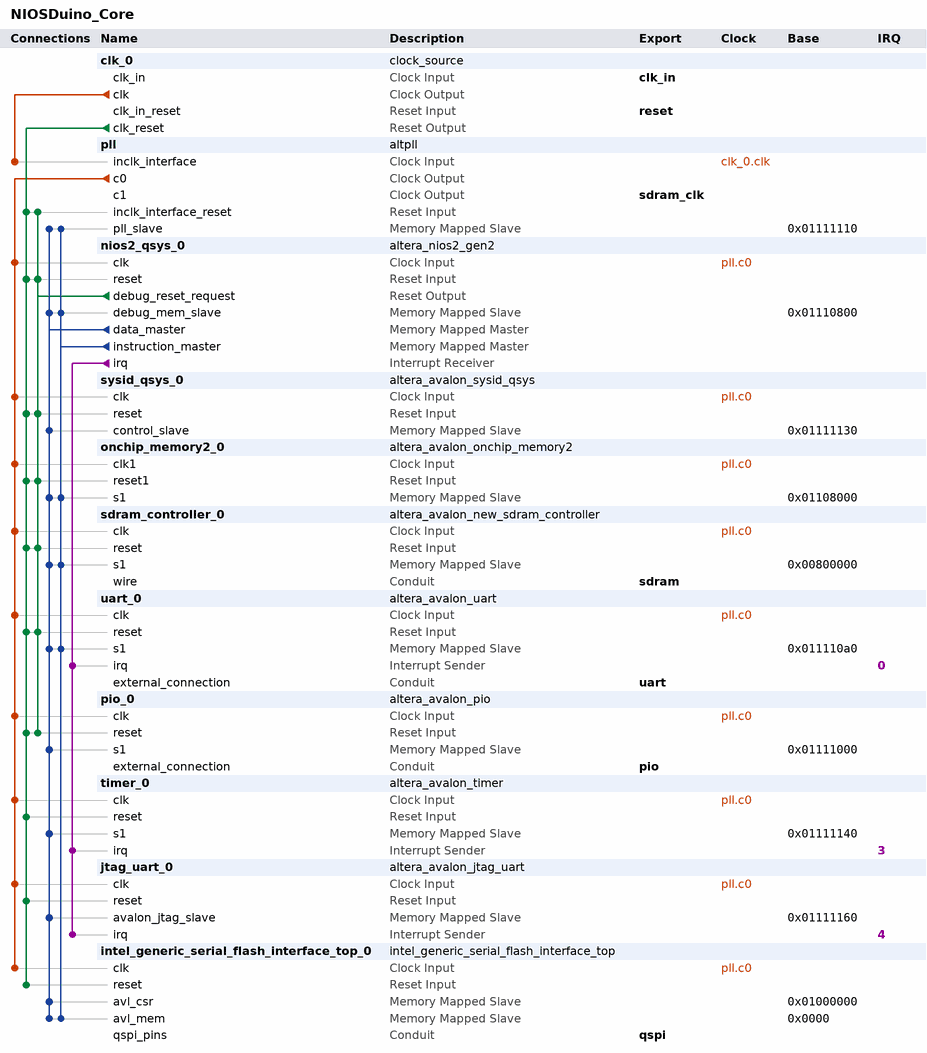
[diagram p0: system contents]
# Platform Designer (Qsys) system NIOSDuino_Core, MAX 10 10M08SAU169C8G
# Parameters at their usual value, and those the tool derives, are not listed.
package require -exact qsys 18.1
create_system NIOSDuino_Core
set_project_property DEVICE_FAMILY {MAX 10}
set_project_property DEVICE 10M08SAU169C8G

add_instance clk_0 clock_source 18.1
set_instance_parameter_value clk_0 clockFrequency 12000000

add_instance pll altpll 18.1
set_instance_parameter_value pll CLK0_DIVIDE_BY 6
set_instance_parameter_value pll CLK0_MULTIPLY_BY 25
set_instance_parameter_value pll CLK1_DIVIDE_BY 6
set_instance_parameter_value pll CLK1_DUTY_CYCLE 50
set_instance_parameter_value pll CLK1_MULTIPLY_BY 25
set_instance_parameter_value pll CLK1_PHASE_SHIFT -5000
set_instance_parameter_value pll INCLK0_INPUT_FREQUENCY 83333
set_instance_parameter_value pll PORT_ARESET PORT_UNUSED
set_instance_parameter_value pll PORT_LOCKED PORT_UNUSED
set_instance_parameter_value pll PORT_clk1 PORT_USED
set_instance_parameter_value pll PORT_clk2 PORT_UNUSED
set_instance_parameter_value pll PORT_clk3 PORT_UNUSED

add_instance nios2_qsys_0 altera_nios2_gen2 18.1
set_instance_parameter_value nios2_qsys_0 dcache_size 2048
set_instance_parameter_value nios2_qsys_0 exceptionSlave onchip_memory2_0.s1
set_instance_parameter_value nios2_qsys_0 icache_size 4096
set_instance_parameter_value nios2_qsys_0 impl Tiny
set_instance_parameter_value nios2_qsys_0 resetSlave intel_generic_serial_flash_interface_top_0.avl_mem

add_instance sysid_qsys_0 altera_avalon_sysid_qsys 18.1
set_instance_parameter_value sysid_qsys_0 id 17149200

add_instance onchip_memory2_0 altera_avalon_onchip_memory2 18.1
set_instance_parameter_value onchip_memory2_0 dataWidth 32
set_instance_parameter_value onchip_memory2_0 dualPort false
set_instance_parameter_value onchip_memory2_0 initMemContent true
set_instance_parameter_value onchip_memory2_0 initializationFileName onchip_mem.hex
set_instance_parameter_value onchip_memory2_0 memorySize 32768
set_instance_parameter_value onchip_memory2_0 useNonDefaultInitFile true

add_instance sdram_controller_0 altera_avalon_new_sdram_controller 18.1
set_instance_parameter_value sdram_controller_0 TAC 6.0
set_instance_parameter_value sdram_controller_0 TRCD 15.0
set_instance_parameter_value sdram_controller_0 TRFC 72.0
set_instance_parameter_value sdram_controller_0 TRP 15.0
set_instance_parameter_value sdram_controller_0 casLatency 2
set_instance_parameter_value sdram_controller_0 columnWidth 8
set_instance_parameter_value sdram_controller_0 dataWidth 16
set_instance_parameter_value sdram_controller_0 generateSimulationModel false
set_instance_parameter_value sdram_controller_0 model single_Micron_MT48LC4M32B2_7_chip
set_instance_parameter_value sdram_controller_0 numberOfBanks 4
set_instance_parameter_value sdram_controller_0 numberOfChipSelects 1
set_instance_parameter_value sdram_controller_0 powerUpDelay 200.0
set_instance_parameter_value sdram_controller_0 refreshPeriod 15.625
set_instance_parameter_value sdram_controller_0 rowWidth 12

add_instance uart_0 altera_avalon_uart 18.1
set_instance_parameter_value uart_0 baud 115200
set_instance_parameter_value uart_0 dataBits 8
set_instance_parameter_value uart_0 fixedBaud true
set_instance_parameter_value uart_0 parity NONE
set_instance_parameter_value uart_0 stopBits 1

add_instance pio_0 altera_avalon_pio 18.1
set_instance_parameter_value pio_0 bitModifyingOutReg true
set_instance_parameter_value pio_0 direction Bidir
set_instance_parameter_value pio_0 width 16

add_instance timer_0 altera_avalon_timer 18.1
set_instance_parameter_value timer_0 period 1
set_instance_parameter_value timer_0 periodUnits MSEC

add_instance jtag_uart_0 altera_avalon_jtag_uart 18.1
set_instance_parameter_value jtag_uart_0 readBufferDepth 32
set_instance_parameter_value jtag_uart_0 simInteractiveOptions NO_INTERACTIVE_WINDOWS
set_instance_parameter_value jtag_uart_0 writeBufferDepth 128

add_instance intel_generic_serial_flash_interface_top_0 intel_generic_serial_flash_interface_top 18.1
set_instance_parameter_value intel_generic_serial_flash_interface_top_0 CHIP_SELECT_BYPASS false
set_instance_parameter_value intel_generic_serial_flash_interface_top_0 CHIP_SELS 1
set_instance_parameter_value intel_generic_serial_flash_interface_top_0 DEBUG_OPTION 0
set_instance_parameter_value intel_generic_serial_flash_interface_top_0 DEFAULT_VALUE_REG_0 1
set_instance_parameter_value intel_generic_serial_flash_interface_top_0 DEFAULT_VALUE_REG_1 1
set_instance_parameter_value intel_generic_serial_flash_interface_top_0 DEFAULT_VALUE_REG_2 0
set_instance_parameter_value intel_generic_serial_flash_interface_top_0 DEFAULT_VALUE_REG_3 0
set_instance_parameter_value intel_generic_serial_flash_interface_top_0 DEFAULT_VALUE_REG_4 139264
set_instance_parameter_value intel_generic_serial_flash_interface_top_0 DEFAULT_VALUE_REG_5 1771
set_instance_parameter_value intel_generic_serial_flash_interface_top_0 DEFAULT_VALUE_REG_6 1282
set_instance_parameter_value intel_generic_serial_flash_interface_top_0 DEFAULT_VALUE_REG_7 6149
set_instance_parameter_value intel_generic_serial_flash_interface_top_0 DEVICE_DENSITY 64
set_instance_parameter_value intel_generic_serial_flash_interface_top_0 ENABLE_SIM_MODEL false
set_instance_parameter_value intel_generic_serial_flash_interface_top_0 PIPE_CMD_GEN_CMD 0
set_instance_parameter_value intel_generic_serial_flash_interface_top_0 PIPE_CSR 0
set_instance_parameter_value intel_generic_serial_flash_interface_top_0 PIPE_MUX_CMD 0
set_instance_parameter_value intel_generic_serial_flash_interface_top_0 PIPE_XIP 0
set_instance_parameter_value intel_generic_serial_flash_interface_top_0 USE_CHIP_SEL_FROM_CSR 1
set_instance_parameter_value intel_generic_serial_flash_interface_top_0 gui_use_asmiblock true
set_instance_parameter_value intel_generic_serial_flash_interface_top_0 gui_use_gpio true

# connections
add_connection clk_0.clk pll.inclk_interface clock
add_connection pll.c0 intel_generic_serial_flash_interface_top_0.clk clock
add_connection pll.c0 jtag_uart_0.clk clock
add_connection pll.c0 nios2_qsys_0.clk clock
add_connection pll.c0 onchip_memory2_0.clk1 clock
add_connection pll.c0 pio_0.clk clock
add_connection pll.c0 sdram_controller_0.clk clock
add_connection pll.c0 sysid_qsys_0.clk clock
add_connection pll.c0 timer_0.clk clock
add_connection pll.c0 uart_0.clk clock
add_connection clk_0.clk_reset intel_generic_serial_flash_interface_top_0.reset reset
add_connection clk_0.clk_reset jtag_uart_0.reset reset
add_connection clk_0.clk_reset nios2_qsys_0.reset reset
add_connection clk_0.clk_reset onchip_memory2_0.reset1 reset
add_connection clk_0.clk_reset pio_0.reset reset
add_connection clk_0.clk_reset pll.inclk_interface_reset reset
add_connection clk_0.clk_reset sdram_controller_0.reset reset
add_connection clk_0.clk_reset sysid_qsys_0.reset reset
add_connection clk_0.clk_reset timer_0.reset reset
add_connection clk_0.clk_reset uart_0.reset reset
add_connection nios2_qsys_0.debug_reset_request nios2_qsys_0.reset reset
add_connection nios2_qsys_0.debug_reset_request onchip_memory2_0.reset1 reset
add_connection nios2_qsys_0.debug_reset_request pio_0.reset reset
add_connection nios2_qsys_0.debug_reset_request pll.inclk_interface_reset reset
add_connection nios2_qsys_0.debug_reset_request sdram_controller_0.reset reset
add_connection nios2_qsys_0.debug_reset_request sysid_qsys_0.reset reset
add_connection nios2_qsys_0.debug_reset_request uart_0.reset reset
add_connection nios2_qsys_0.data_master intel_generic_serial_flash_interface_top_0.avl_csr avalon
set_connection_parameter_value nios2_qsys_0.data_master/intel_generic_serial_flash_interface_top_0.avl_csr baseAddress 0x01000000
add_connection nios2_qsys_0.data_master intel_generic_serial_flash_interface_top_0.avl_mem avalon
set_connection_parameter_value nios2_qsys_0.data_master/intel_generic_serial_flash_interface_top_0.avl_mem baseAddress 0x0000
add_connection nios2_qsys_0.data_master jtag_uart_0.avalon_jtag_slave avalon
set_connection_parameter_value nios2_qsys_0.data_master/jtag_uart_0.avalon_jtag_slave baseAddress 0x01111160
add_connection nios2_qsys_0.data_master nios2_qsys_0.debug_mem_slave avalon
set_connection_parameter_value nios2_qsys_0.data_master/nios2_qsys_0.debug_mem_slave baseAddress 0x01110800
add_connection nios2_qsys_0.data_master onchip_memory2_0.s1 avalon
set_connection_parameter_value nios2_qsys_0.data_master/onchip_memory2_0.s1 baseAddress 0x01108000
add_connection nios2_qsys_0.data_master pio_0.s1 avalon
set_connection_parameter_value nios2_qsys_0.data_master/pio_0.s1 baseAddress 0x01111000
add_connection nios2_qsys_0.data_master pll.pll_slave avalon
set_connection_parameter_value nios2_qsys_0.data_master/pll.pll_slave baseAddress 0x01111110
add_connection nios2_qsys_0.data_master sdram_controller_0.s1 avalon
set_connection_parameter_value nios2_qsys_0.data_master/sdram_controller_0.s1 baseAddress 0x00800000
add_connection nios2_qsys_0.data_master sysid_qsys_0.control_slave avalon
set_connection_parameter_value nios2_qsys_0.data_master/sysid_qsys_0.control_slave baseAddress 0x01111130
add_connection nios2_qsys_0.data_master timer_0.s1 avalon
set_connection_parameter_value nios2_qsys_0.data_master/timer_0.s1 baseAddress 0x01111140
add_connection nios2_qsys_0.data_master uart_0.s1 avalon
set_connection_parameter_value nios2_qsys_0.data_master/uart_0.s1 baseAddress 0x011110a0
add_connection nios2_qsys_0.instruction_master intel_generic_serial_flash_interface_top_0.avl_mem avalon
set_connection_parameter_value nios2_qsys_0.instruction_master/intel_generic_serial_flash_interface_top_0.avl_mem baseAddress 0x0000
add_connection nios2_qsys_0.instruction_master nios2_qsys_0.debug_mem_slave avalon
set_connection_parameter_value nios2_qsys_0.instruction_master/nios2_qsys_0.debug_mem_slave baseAddress 0x01110800
add_connection nios2_qsys_0.instruction_master onchip_memory2_0.s1 avalon
set_connection_parameter_value nios2_qsys_0.instruction_master/onchip_memory2_0.s1 baseAddress 0x01108000
add_connection nios2_qsys_0.instruction_master pll.pll_slave avalon
set_connection_parameter_value nios2_qsys_0.instruction_master/pll.pll_slave baseAddress 0x01111110
add_connection nios2_qsys_0.instruction_master sdram_controller_0.s1 avalon
set_connection_parameter_value nios2_qsys_0.instruction_master/sdram_controller_0.s1 baseAddress 0x00800000
add_connection nios2_qsys_0.instruction_master uart_0.s1 avalon
set_connection_parameter_value nios2_qsys_0.instruction_master/uart_0.s1 baseAddress 0x011110a0
add_connection nios2_qsys_0.irq jtag_uart_0.irq interrupt
set_connection_parameter_value nios2_qsys_0.irq/jtag_uart_0.irq irqNumber 4
add_connection nios2_qsys_0.irq timer_0.irq interrupt
set_connection_parameter_value nios2_qsys_0.irq/timer_0.irq irqNumber 3
add_connection nios2_qsys_0.irq uart_0.irq interrupt
set_connection_parameter_value nios2_qsys_0.irq/uart_0.irq irqNumber 0

# exported interfaces
add_interface clk_in clock sink
set_interface_property clk_in EXPORT_OF clk_0.clk_in
add_interface pio conduit end
set_interface_property pio EXPORT_OF pio_0.external_connection
add_interface qspi conduit end
set_interface_property qspi EXPORT_OF intel_generic_serial_flash_interface_top_0.qspi_pins
add_interface reset reset sink
set_interface_property reset EXPORT_OF clk_0.clk_in_reset
add_interface sdram conduit end
set_interface_property sdram EXPORT_OF sdram_controller_0.wire
add_interface sdram_clk clock source
set_interface_property sdram_clk EXPORT_OF pll.c1
add_interface uart conduit end
set_interface_property uart EXPORT_OF uart_0.external_connection

set_interconnect_requirement {$system} qsys_mm.clockCrossingAdapter HANDSHAKE
set_interconnect_requirement {$system} qsys_mm.enableEccProtection FALSE
set_interconnect_requirement {$system} qsys_mm.insertDefaultSlave FALSE
set_interconnect_requirement {$system} qsys_mm.maxAdditionalLatency 1

save_system NIOSDuino_Core.qsys
